# EasyEDA schematic support mega2560 pro mini_shematic.json
TITLE: Sheet_2; REV: 1.0; Date: 2021-01-02; Sheet: 1/1; Drawn By: krok; Company: Your Company
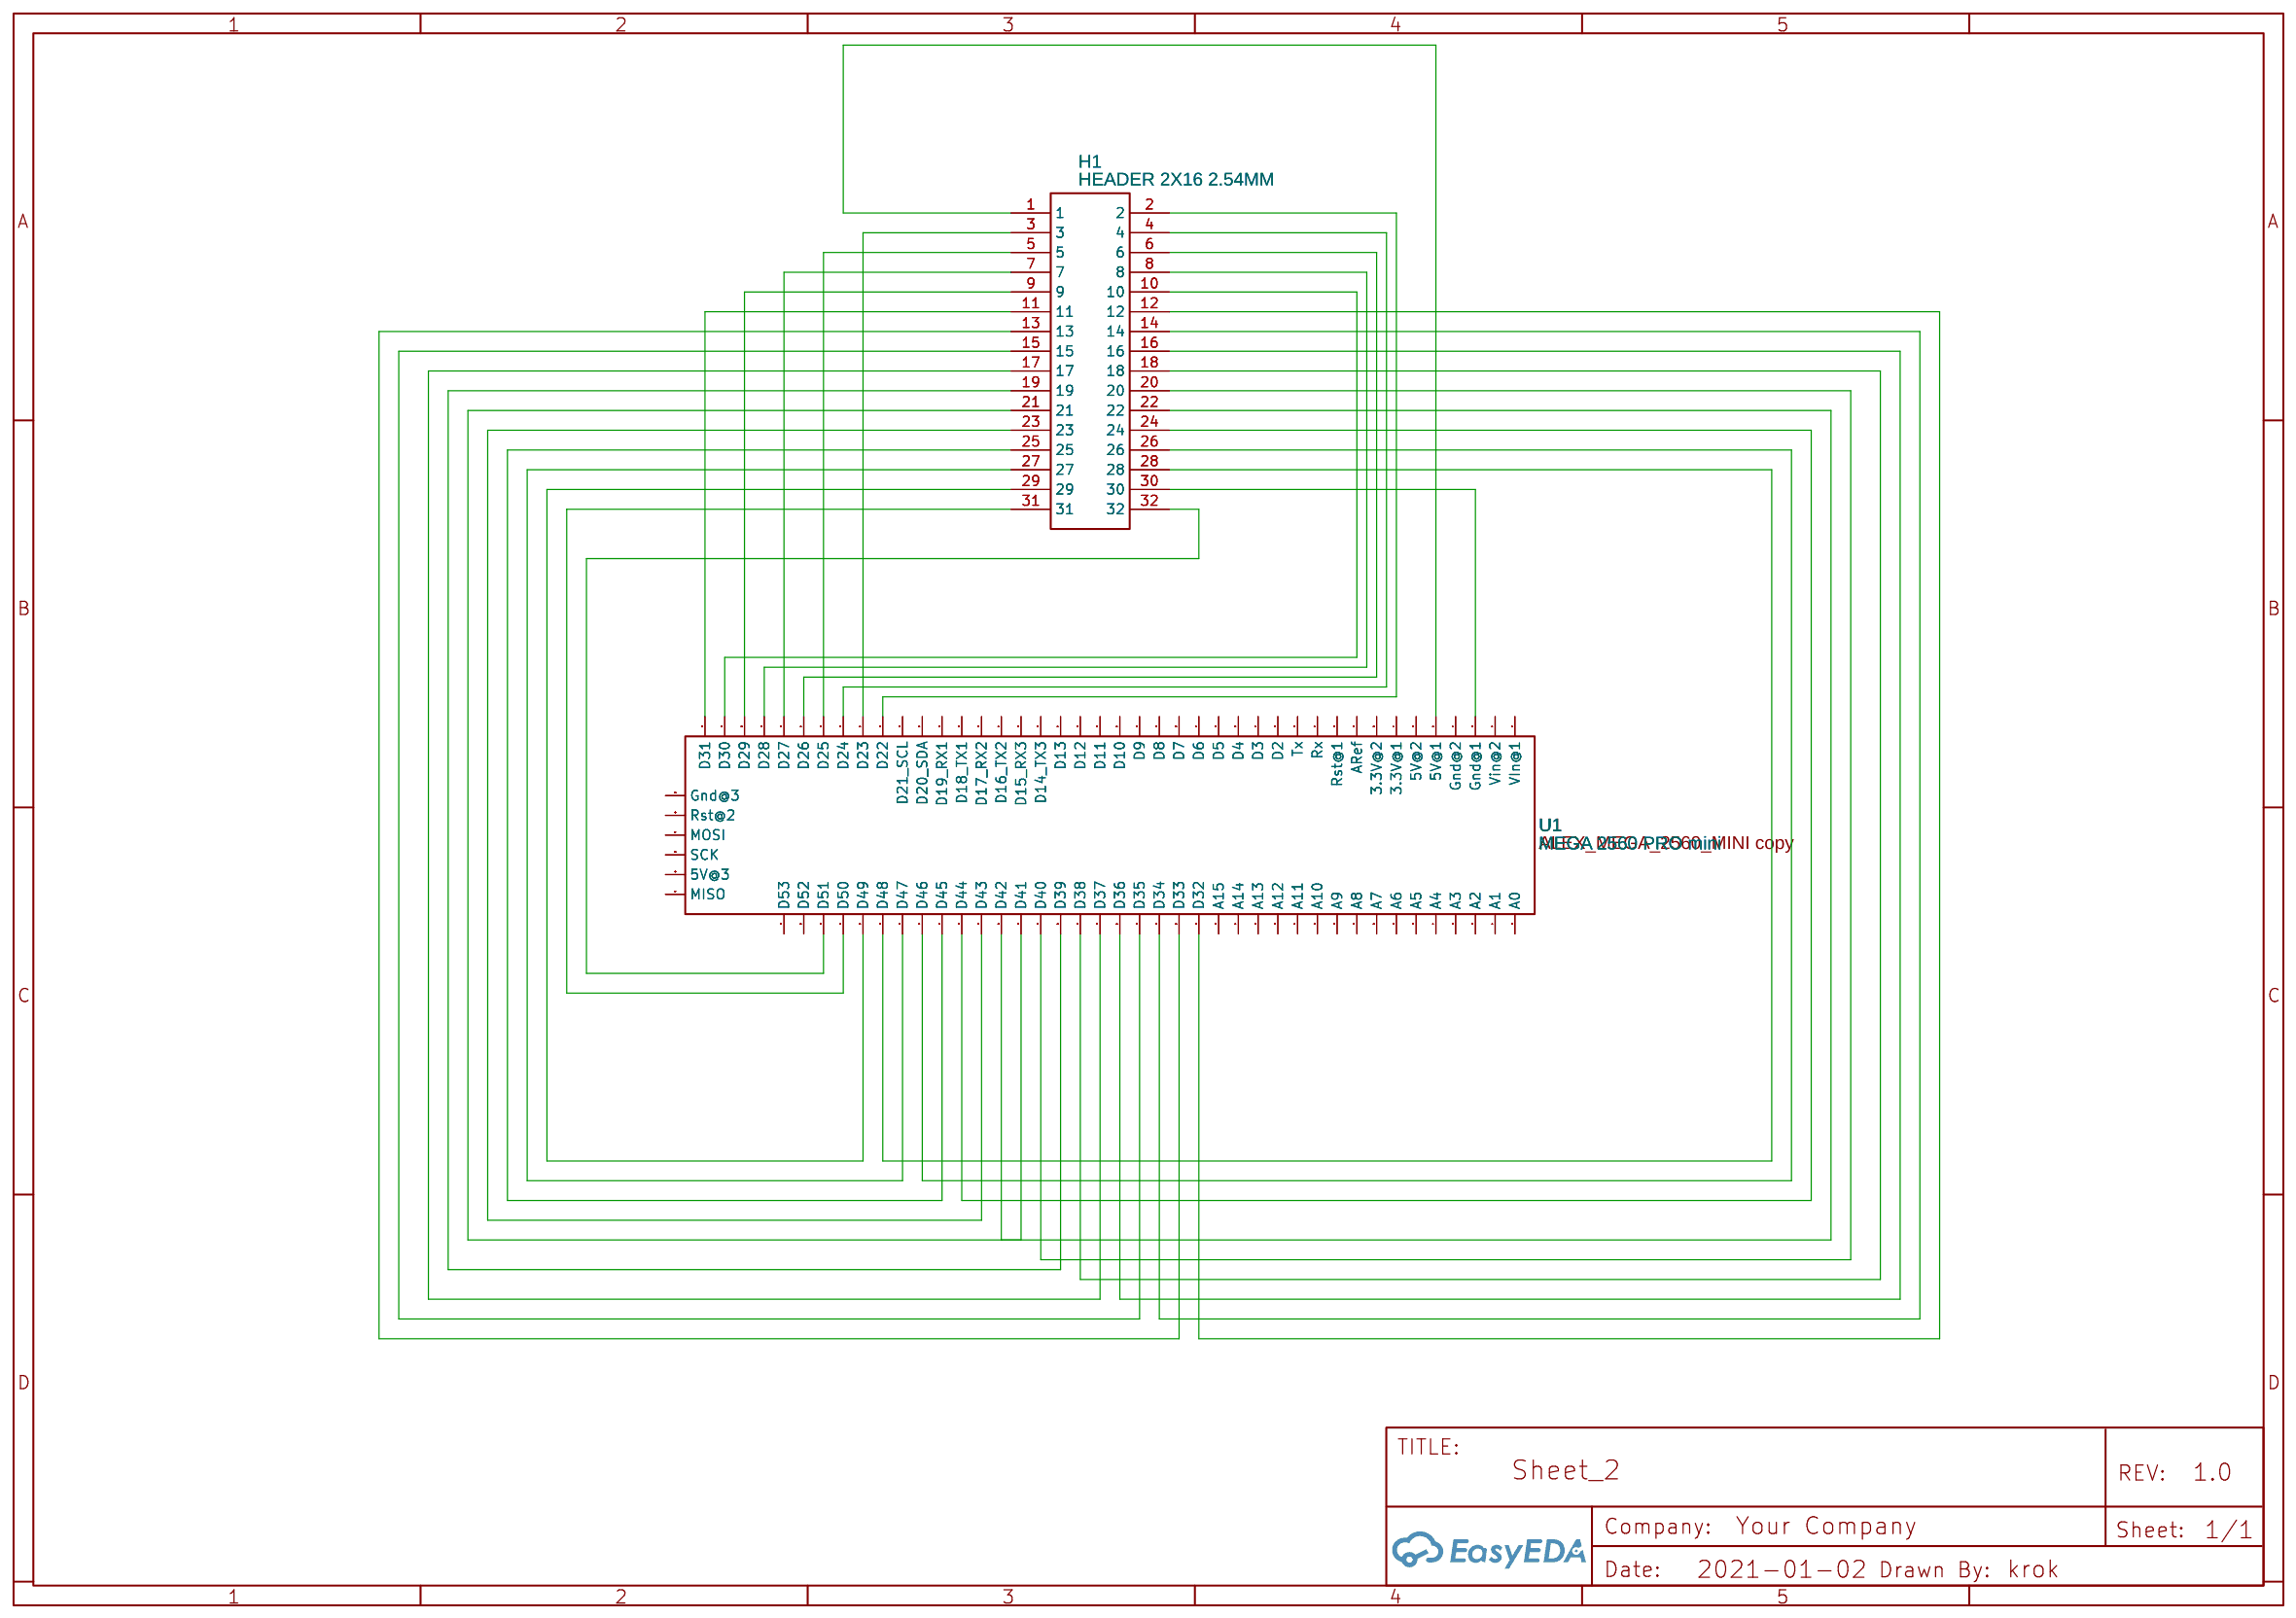
[diagram p0: schematic sheet]

## Parts
H1  HEADER 2X16 2.54MM  [DIP-2X16P-2.54MM]
U1  MEGA 2560 PRO mini  [MEGA 2560 PRO MINI]

## Library data of the parts
H1 = HEADER 2X16 2.54MM: Supplier: LCSC; Manufacturer: CONNFLY; Manufacturer Part: DS1023-2*16SF11; Contributor: HAIIM; Supplier Part: C132130
U1 = MEGA 2560 PRO mini: Contributor: Obormot Obormot

## Nets
Net-(H1-1): H1.1 U1.5(5V@1)
Net-(H1-2): H1.2 U1.33(D22)
Net-(H1-3): H1.3 U1.34(D23)
Net-(H1-4): H1.4 U1.35(D24)
Net-(H1-5): H1.5 U1.36(D25)
Net-(H1-6): H1.6 U1.37(D26)
Net-(H1-7): H1.7 U1.38(D27)
Net-(H1-8): H1.8 U1.39(D28)
Net-(H1-9): H1.9 U1.40(D29)
Net-(H1-10): H1.10 U1.41(D30)
Net-(H1-11): H1.11 U1.42(D31)
Net-(H1-12): H1.12 U1.59(D32)
Net-(H1-13): H1.13 U1.60(D33)
Net-(H1-14): H1.14 U1.61(D34)
Net-(H1-15): H1.15 U1.62(D35)
Net-(H1-16): H1.16 U1.63(D36)
Net-(H1-17): H1.17 U1.64(D37)
Net-(H1-18): H1.18 U1.65(D38)
Net-(H1-19): H1.19 U1.66(D39)
Net-(H1-20): H1.20 U1.67(D40)
Net-(H1-21): H1.21 U1.68(D41)
Net-(H1-22): H1.22 U1.69(D42)
Net-(H1-23): H1.23 U1.70(D43)
Net-(H1-24): H1.24 U1.71(D44)
Net-(H1-25): H1.25 U1.72(D45)
Net-(H1-26): H1.26 U1.73(D46)
Net-(H1-27): H1.27 U1.74(D47)
Net-(H1-28): H1.28 U1.75(D48)
Net-(H1-29): H1.29 U1.76(D49)
Net-(H1-30): H1.30 U1.3(Gnd@1)
Net-(H1-31): H1.31 U1.77(D50)
Net-(H1-32): H1.32 U1.78(D51)

Not connected (* = marked no-connect by the designer): U1 1(VIn@1) 2(Vin@2) 4(Gnd@2) 6(5V@2) 7(3.3V@1) 8(3.3V@2) 9(ARef) 10(Rst@1) 11(Rx) 12(Tx) 13(D2) 14(D3) 15(D4) 16(D5) 17(D6) 18(D7) 19(D8) 20(D9) 21(D10) 22(D11) 23(D12) 24(D13) 25(D14_TX3) 26(D15_RX3) 27(D16_TX2) 28(D17_RX2) 29(D18_TX1) 30(D19_RX1) 31(D20 SDA) 32(D21 SCL) 43(A0) 44(A1) 45(A2) 46(A3) 47(A4) 48(A5) 49(A6) 50(A7) 51(A8) 52(A9) 53(A10) 54(A11) 55(A12) 56(A13) 57(A14) 58(A15) 79(D52) 80(D53) 81(MISO) 82(5V@3) 83(SCK) 84(MOSI) 85(Rst@2) 86(Gnd@3)
